# EAGLE design Antenna_analyzer_shield (EAGLE 8.3.1)
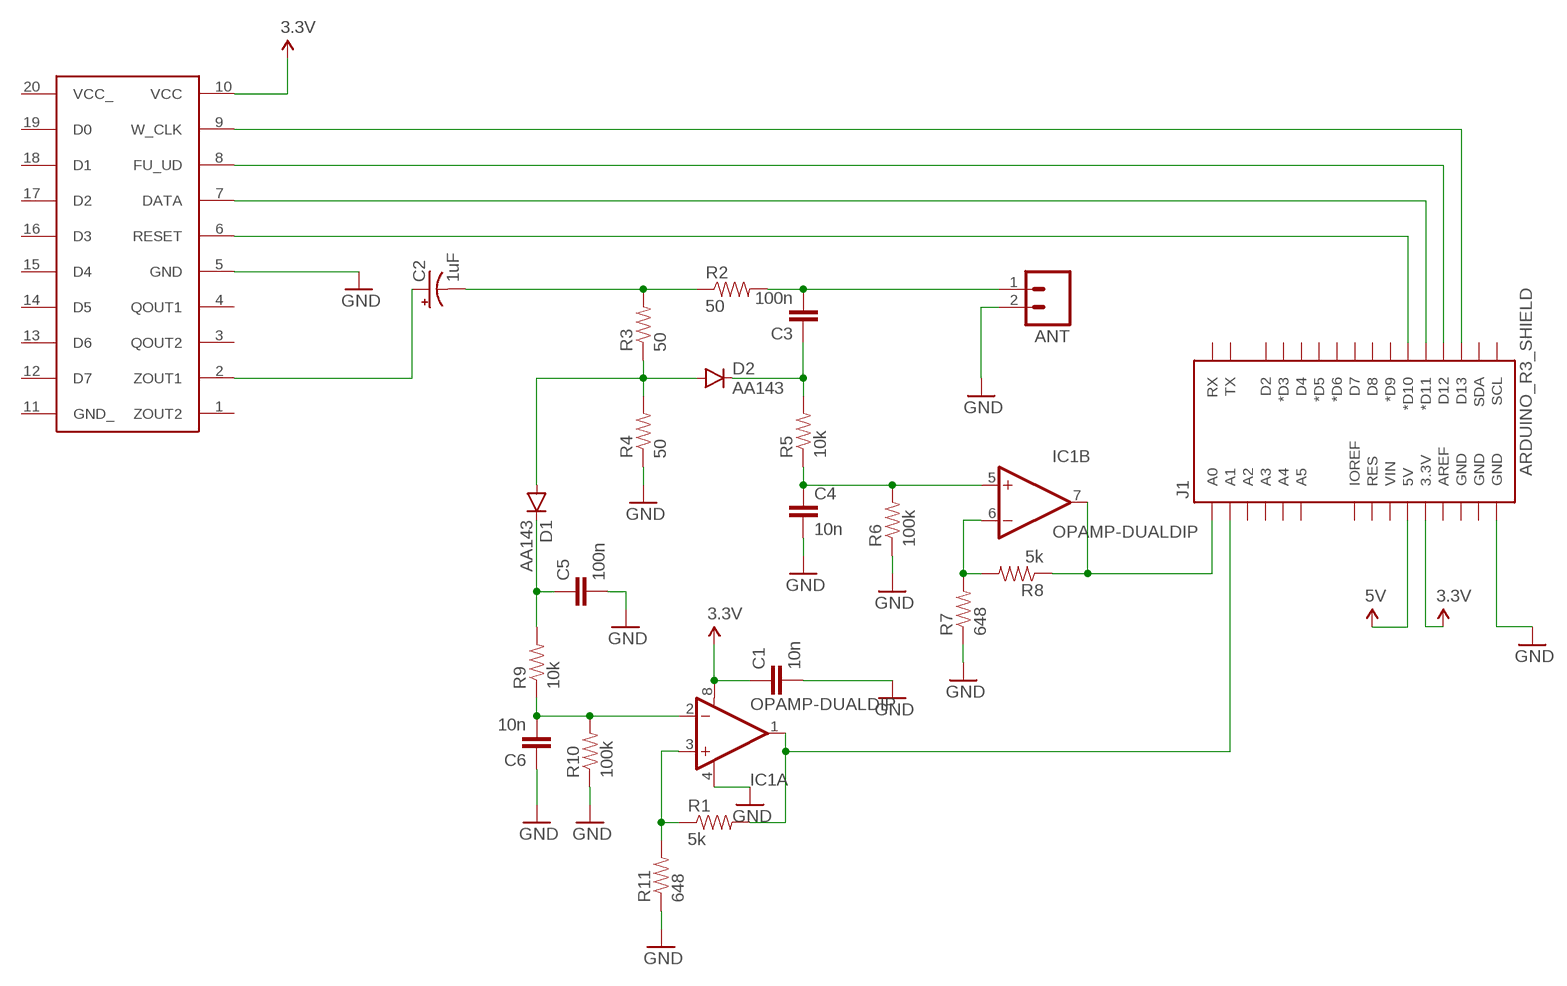
[diagram p0: schematic, sheet 1]

## Parts
ANT  M023.5MM  [SCREWTERMINAL-3.5MM-2]
C1  10n  CAPPTH2  [CAP-PTH-SMALL2]
C2  1uF  CAP_POLPTH2  [CPOL-RADIAL-10UF-25V]
C3  100n  CAPPTH2  [CAP-PTH-SMALL2]
C4  10n  CAPPTH2  [CAP-PTH-SMALL2]
C5  100n  CAPPTH2  [CAP-PTH-SMALL2]
C6  10n  CAPPTH2  [CAP-PTH-SMALL2]
D1  AA143  DIODEPTH  [DIODE-1N4001]
D2  AA143  DIODEPTH  [DIODE-1N4001]
IC1  OPAMP-DUALDIP  [DIP08]
J1  ARDUINO_R3_SHIELD  [UNO_R3_SHIELD]
R1  5k  RESISTORPTH-1/4W  [AXIAL-0.4]
R2  50  RESISTORPTH-1/4W  [AXIAL-0.4]
R3  50  RESISTORPTH-1/4W  [AXIAL-0.4]
R4  50  RESISTORPTH-1/4W  [AXIAL-0.4]
R5  10k  RESISTORPTH-1/4W  [AXIAL-0.4]
R6  100k  RESISTORPTH-1/4W  [AXIAL-0.4]
R7  648  RESISTORPTH-1/4W  [AXIAL-0.4]
R8  5k  RESISTORPTH-1/4W  [AXIAL-0.4]
R9  10k  RESISTORPTH-1/4W  [AXIAL-0.4]
R10  100k  RESISTORPTH-1/4W  [AXIAL-0.4]
R11  648  RESISTORPTH-1/4W  [AXIAL-0.4]
U$1  DDS  [1X10_NO_SILK]

## Nets
5V: C1.1 IC1.8(A:V+) J1.3.3V J1.5V U$1.10(VCC) ; supply symbol labelled 3.3V
GND: ANT.2 C1.2 C4.2 C5.2 C6.1 IC1.4(A:V-) J1.GND@0(GND) R4.P$1 R6.P$1 R7.P$1 R10.P$1 R11.P$1 U$1.5(GND)
N$1: C2.2(-) R2.P$1 R3.P$2
N$2: ANT.1 C3.2 R2.P$2
N$3: D1.A D2.A R3.P$1 R4.P$2
N$4: C3.1 D2.C R5.P$2
N$5: C4.1 IC1.5(B:+IN) R5.P$1 R6.P$2
N$6: IC1.6(B:-IN) R7.P$2 R8.P$2
N$7: IC1.7(B:OUT) J1.A0 R8.P$1
N$8: C6.2 IC1.2(A:-IN) R9.P$1 R10.P$2
N$9: IC1.3(A:+IN) R1.P$1 R11.P$2
N$10: IC1.1(A:OUT) J1.A1 R1.P$2
N$11: C5.1 D1.C R9.P$2
N$12: C2.1(+) U$1.2(ZOUT1)
N$13: J1.D13 U$1.9(W_CLK)
N$14: J1.D12 U$1.8(FU_UD)
N$15: J1.D11(*D11) U$1.7(DATA)
N$16: J1.D10(*D10) U$1.6(RESET)
Unconnected: J1.A2 J1.A3 J1.A4 J1.A5 J1.AREF J1.D2 J1.D3(*D3) J1.D4 J1.D5(*D5) J1.D6(*D6) J1.D7 J1.D8 J1.D9(*D9) J1.GND@1(GND) J1.GND@2(GND) J1.IOREF J1.RES J1.RX J1.SCL J1.SDA J1.TX J1.VIN U$1.1(ZOUT2) U$1.3(QOUT2) U$1.4(QOUT1) U$1.11(GND_) U$1.12(D7) U$1.13(D6) U$1.14(D5) U$1.15(D4) U$1.16(D3) U$1.17(D2) U$1.18(D1) U$1.19(D0) U$1.20(VCC_)

## Library data of the parts
ANT = SparkFun-Connectors:M02: Standard 2-pin 0.1" header. Use with - straight break away headers ( PRT-00116) - right angle break away headers (PRT-00553) - swiss pins (PRT-00743) - machine pins (PRT-00117) - female headers (PRT-00115) Molex polarized connector foot print use with: PRT-08233 with associated crimp pins and housings. 2.54_SCREWTERM for use with PRT-10571. 3.5mm Screw Terminal footprints for PRT-08084 5mm Screw Terminal footprints for use with PRT-08432; PROD_ID: CONN-08399
C1 C3-C6 = SparkFun-Capacitors:CAP: Capacitor Standard 0603 ceramic capacitor, and 0.1" leaded capacitor.
C2 = SparkFun-Capacitors:CAP_POL: Capacitor Polarized These are standard SMD and PTH capacitors. Normally 10uF, 47uF, and 100uF in electrolytic and tantalum varieties. Always verify the external diameter of the through hole cap, it varies with capacity, voltage, and manufacturer. The EIA devices should be standard.
D1 D2 = SparkFun-DiscreteSemi:DIODE: Diode These are standard reverse protection diodes and small signal diodes. SMA package can handle up to about 1A. SOD-323 can handle about 200mA. What the SOD-323 package when ordering, there are some mfgs out there that are 5-pin packages.
IC1 = SparkFun-AnalogIC:OPAMP-DUAL: Generic op-amp footprint
J1 = SparkFun-Boards:ARDUINO_R3_SHIELD: Shield form compatible with the Arduino Uno R3.
R1-R11 = SparkFun-Passives:RESISTOR: Resistor Basic schematic elements and footprints for 0603, 1206, and PTH resistors.
U$1 = CSP4:DDS

## Board
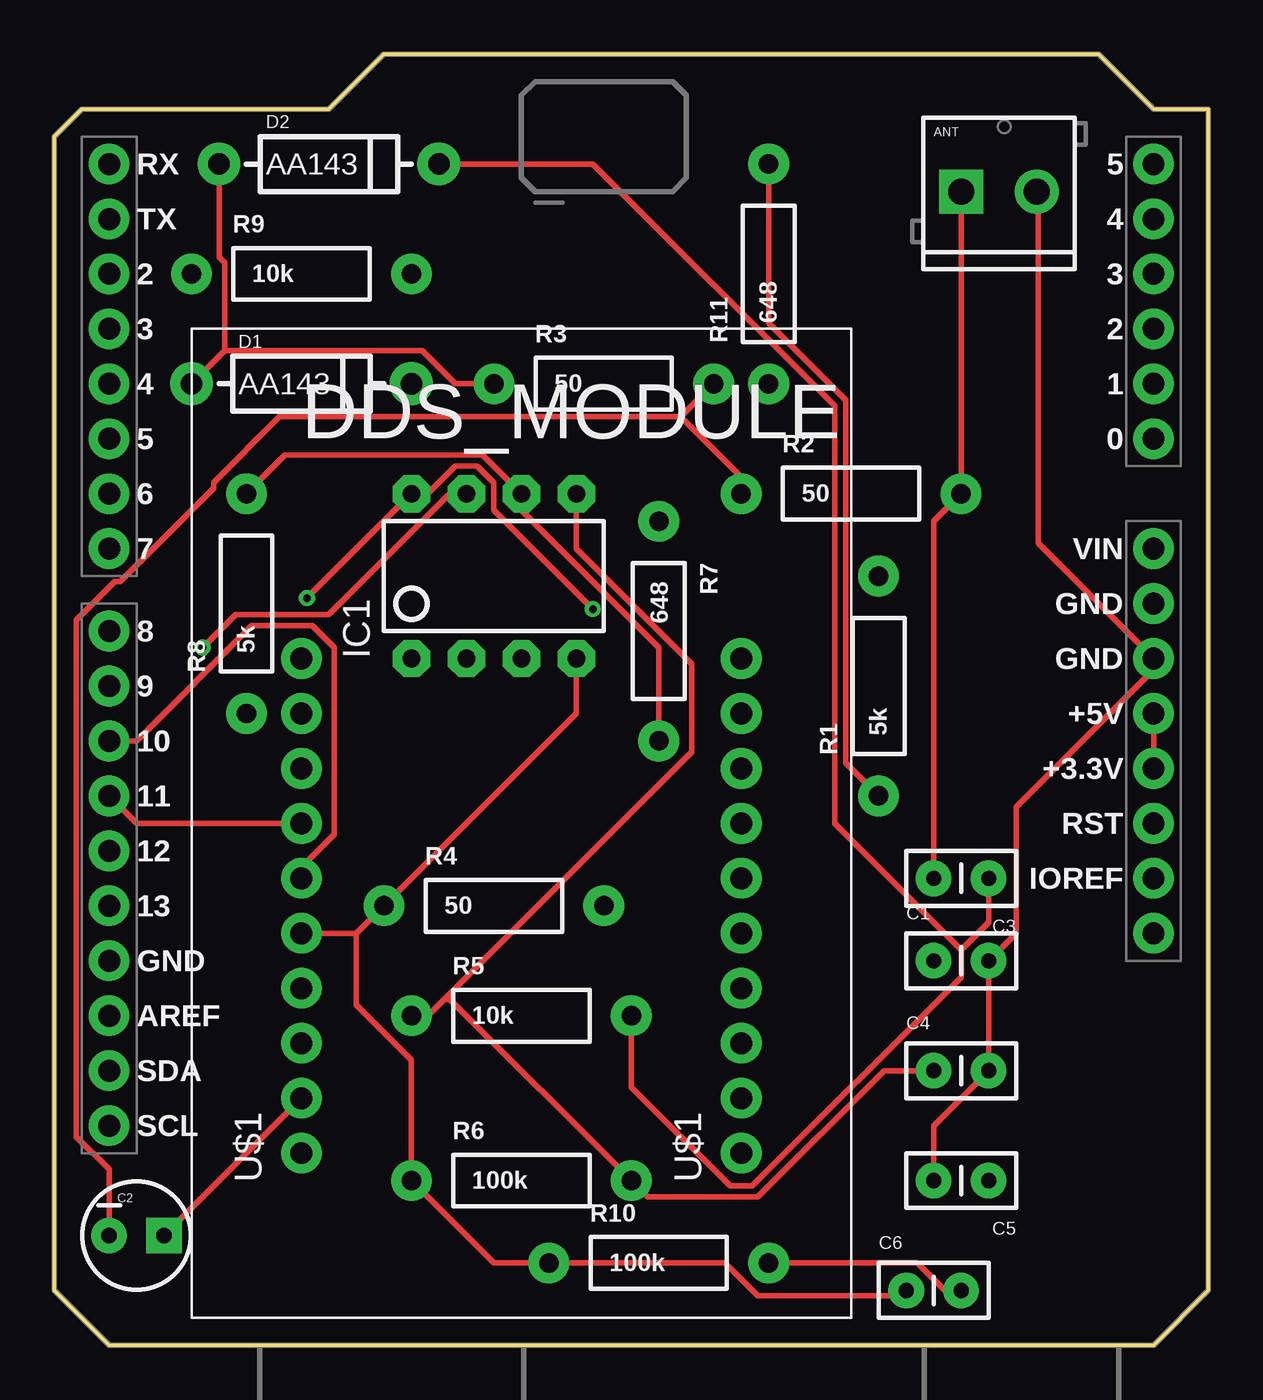
[diagram p1: board, top side]
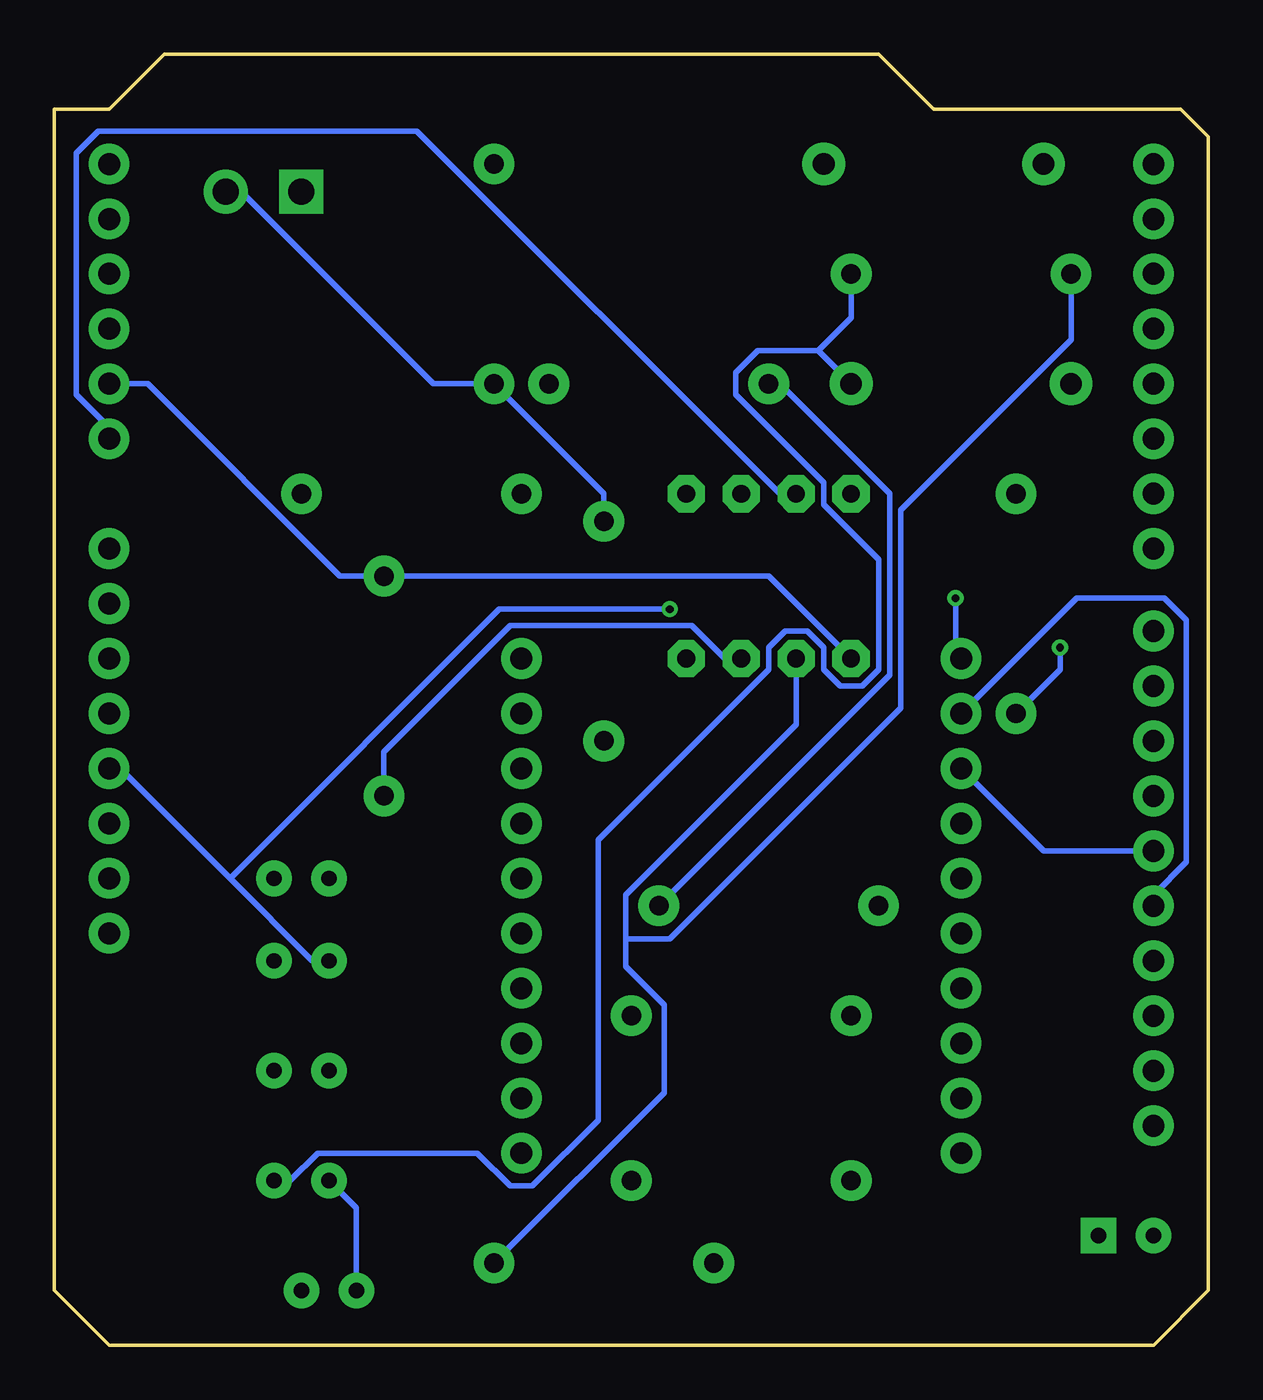
[diagram p2: board, bottom side, seen from below]

Size 53.34 x 59.69 mm. Coordinates in mm from the lower left corner, seen from the top.
Outline: 2.54,0 50.8,0 53.34,2.54 53.34,57.15 50.8,57.15 48.26,59.69 15.24,59.69 12.7,57.15 1.27,57.15 0,55.88 0,2.54 2.54,0
Copper layers (1*16): Top 0.035mm / dielectric 1.5mm / Bottom 0.035mm
Design rules "default *": minimum track width 10mil, minimum drill 0.35mm, track to track 10mil, track to pad 10mil, pad to pad 10mil, via to via 10mil, smd to smd 6mil, copper to edge 40mil, drill to drill 6mil, minimum pad ring 10mil, minimum via ring 8mil, stop-mask expansion 4mil, vias tented up to drill 0mil, thermal gap 10mil

### Footprints (pad centres in the part's own frame; a part is rotated, then mirrored left to right if it is on the bottom)
SCREWTERMINAL-3.5MM-2 = drill 1.2 pad 2.032 square: 1 0,0 | drill 1.2 pad 2.032: 2 3.5,0
CAP-PTH-SMALL2 = drill 0.7 pad 1.651: 1 0,0; 2 2.54,0
CPOL-RADIAL-10UF-25V = drill 0.7 pad 1.651 square: 1 1.27,0 | drill 0.7 pad 1.651: 2 -1.27,0
DIODE-1N4001 = drill 1 pad 1.981: A -5.08,0; C 5.08,0
DIP08 = drill 0.813 pad 1.727 octagon: 1 -3.81,-3.81; 2 -1.27,-3.81; 3 1.27,-3.81; 4 3.81,-3.81; 5 3.81,3.81; 6 1.27,3.81; 7 -1.27,3.81; 8 -3.81,3.81
UNO_R3_SHIELD = drill 1.016 pad 1.88: 3.3V 50.8,26.67; 5V 50.8,29.21; A0 50.8,41.91; A1 50.8,44.45; A2 50.8,46.99; A3 50.8,49.53; A4 50.8,52.07; A5 50.8,54.61; AREF 2.54,15.24; D2 2.54,49.53; D3 2.54,46.99; D4 2.54,44.45; D5 2.54,41.91; D6 2.54,39.37; D7 2.54,36.83; D8 2.54,33.02; D9 2.54,30.48; D10 2.54,27.94; D11 2.54,25.4; D12 2.54,22.86; D13 2.54,20.32; GND@0 50.8,31.75; GND@1 50.8,34.29; GND@2 2.54,17.78; IOREF 50.8,21.59; NC 50.8,19.05; RES 50.8,24.13; RX 2.54,54.61; SCL 2.54,10.16; SDA 2.54,12.7; TX 2.54,52.07; VIN 50.8,36.83
AXIAL-0.4 = drill 0.9 pad 1.88: P$1 -5.08,0; P$2 5.08,0
1X10_NO_SILK = drill 1.016 pad 1.88: 1 -8.89,-29.21; 2 -8.89,-26.67; 3 -8.89,-24.13; 4 -8.89,-21.59; 5 -8.89,-19.05; 6 -8.89,-16.51; 7 -8.89,-13.97; 8 -8.89,-11.43; 9 -8.89,-8.89; 10 -8.89,-6.35; 11 11.43,-29.21; 12 11.43,-26.67; 13 11.43,-24.13; 14 11.43,-21.59; 15 11.43,-19.05; 16 11.43,-16.51; 17 11.43,-13.97; 18 11.43,-11.43; 19 11.43,-8.89; 20 11.43,-6.35

### Placement (x,y rotation side)
ANT  41.91,53.34 0 top
C1  40.64,17.78 0 top
C2  3.81,5.08 0 top
C3  43.18,21.59 180 top
C4  40.64,12.7 0 top
C5  43.18,7.62 180 top
C6  39.37,2.54 0 top
D1  11.43,44.45 0 top
D2  12.7,54.61 0 top
IC1  20.32,35.56 0 top
J1  0,0 0 top
R1  38.1,30.48 90 top
R2  36.83,39.37 0 top
R3  25.4,44.45 0 top
R4  20.32,20.32 0 top
R5  21.59,15.24 0 top
R6  21.59,7.62 0 top
R7  27.94,33.02 270 top
R8  8.89,34.29 90 top
R9  11.43,49.53 0 top
R10  27.94,3.81 0 top
R11  33.02,49.53 90 top
U$1  20.32,38.1 0 top

### Tracks (layer width: path | path; a pad name or v marks a point on that pad's centre or on a via)
5V  (via drill 0.35)
  Top 0.254: v11.68,34.54 IC1.8 17.27,39.37 18.54,40.64 19.56,40.64 20.32,39.88 20.32,38.61 v24.89,34.04 | J1.3.3V J1.5V
  Bottom 0.254: v11.68,34.54 11.68,32 U$1.10 | C1.1 41.4,17.78 45.21,21.59 | 45.21,21.59 50.29,26.67 J1.3.3V | v24.89,34.04 32.77,34.04 45.21,21.59
GND
  Top 0.254: IC1.4 24.13,29.21 R4.P$1 13.97,19.05 | 13.97,19.05 U$1.5 | 13.97,19.05 13.97,15.75 16.51,13.21 R6.P$1 20.32,3.81 R10.P$1 30.99,3.81 32.51,2.29 39.12,2.29 C6.1 | C5.2 40.64,10.16 C4.2 C1.2 44.45,19.05 44.45,24.89 50.8,31.24 J1.GND@0 45.47,37.08 45.47,53.34 ANT.2
  Bottom 0.254: R7.P$1 27.94,39.37 R11.P$1 35.81,44.45 44.7,53.34 ANT.2 | C6.1 39.37,6.35 C5.2
N$1
  Top 0.254: C2.2 2.54,8.13 1.02,9.65 1.02,33.53 2.79,35.31 3.05,35.31 7.37,39.62 7.37,39.88 10.41,42.93 28.96,42.93 | R3.P$2 28.96,42.93 | R2.P$1 31.75,40.13 28.96,42.93
N$2
  Top 0.254: C3.2 40.64,38.1 R2.P$2 ANT.1
N$3
  Top 0.254: R3.P$1 18.54,44.45 17.02,45.97 7.87,45.97 | D1.A 7.87,45.97 | D2.A 7.62,50.29 7.87,50.04 7.87,45.97
  Bottom 0.254: R4.P$2 14.73,30.99 14.73,39.37 19.81,44.45 R3.P$1
N$4
  Top 0.254: C3.1 43.18,19.56 41.91,18.29 | 41.91,18.29 41.91,17.02 32.26,7.37 31.24,7.37 26.67,11.94 R5.P$2 | D2.C 24.89,54.61 36.07,43.43 36.07,24.13 41.91,18.29
N$5
  Top 0.254: C4.1 38.35,12.7 32.51,6.86 27.43,6.86 R6.P$2 18.29,16 18.03,16 | IC1.5 24.13,36.83 29.46,31.5 29.46,27.43 18.03,16 | 18.03,16 17.27,15.24 R5.P$1
N$6
  Top 0.254: R8.P$2 10.67,41.15 19.81,41.15 IC1.6 21.59,38.61 27.94,32.26 R7.P$2
N$7  (via drill 0.35)
  Top 0.254: IC1.7 18.29,39.37 12.7,33.78 8.38,33.78 v6.86,32.26
  Bottom 0.254: v6.86,32.26 6.86,31.24 R8.P$1 | J1.A0 50.8,42.42 52.32,43.94 52.32,55.12 51.31,56.13 36.58,56.13 19.81,39.37 IC1.7
N$8
  Top 0.254: C6.2 41.15,2.54 39.88,3.81 R10.P$2
  Bottom 0.254: IC1.2 19.05,28.7 26.92,20.83 26.92,18.8 | 26.92,18.8 26.92,17.53 25.15,15.75 25.15,11.68 R10.P$2 | R9.P$1 6.35,46.48 14.22,38.61 14.22,29.46 24.89,18.8 26.92,18.8
N$9
  Top 0.254: R11.P$2 33.02,47.24 36.58,43.69 36.58,26.92 R1.P$1
  Bottom 0.254: IC1.3 22.35,31.75 23.88,33.27 32.26,33.27 38.1,27.43 R1.P$1
N$10
  Bottom 0.254: IC1.1 20.32,35.56 R1.P$2 40.13,35.56 49.02,44.45 J1.A1
N$11
  Bottom 0.254: C5.1 42.42,7.62 41.15,8.89 33.78,8.89 32.26,7.37 31.24,7.37 28.19,10.41 28.19,23.37 20.32,31.24 20.32,32.26 19.56,33.02 18.54,33.02 17.78,32.26 17.78,31.24 17.02,30.48 16,30.48 15.24,31.24 15.24,36.32 17.78,38.86 17.78,39.88 21.84,43.94 21.84,44.96 20.83,45.97 18.03,45.97 | D1.C 18.03,45.97 | R9.P$2 16.51,47.5 18.03,45.97
N$12
  Top 0.254: U$1.2 C2.1
N$13
  Bottom 0.254: J1.D13 2.54,20.83 1.02,22.35 1.02,33.53 2.03,34.54 6.1,34.54 U$1.9
N$14
  Bottom 0.254: J1.D12 7.62,22.86 U$1.8
N$15
  Top 0.254: U$1.7 3.81,24.13 J1.D11
N$16
  Top 0.254: U$1.6 11.43,22.1 12.95,23.62 12.95,32.26 11.94,33.27 9.14,33.27 3.81,27.94 J1.D10